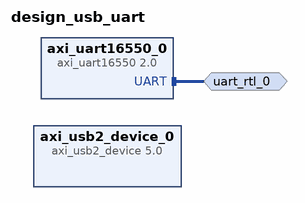
[diagram p0: block diagram of the top level]
# Vivado block design design_usb_uart, xc7a100tcsg324-3, Vivado 2018.2
create_bd_design design_usb_uart

create_bd_intf_port -mode Master -vlnv xilinx.com:interface:uart_rtl:1.0 uart_rtl_0

create_bd_cell -type ip -vlnv xilinx.com:ip:axi_usb2_device:5.0 axi_usb2_device_0
create_bd_cell -type ip -vlnv xilinx.com:ip:axi_uart16550:2.0 axi_uart16550_0

# ---- connections ----

connect_bd_intf_net [get_bd_intf_ports uart_rtl_0] [get_bd_intf_pins axi_uart16550_0/UART]

validate_bd_design
save_bd_design
